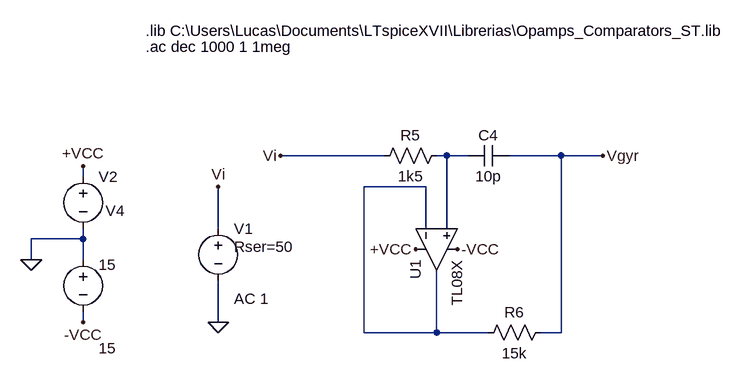
[diagram p0: schematic gyrator.asc]
gyrator.asc, the LTspice schematic file:
Version 4
SHEET 1 932 816
WIRE 192 336 32 336
WIRE 288 336 272 336
WIRE 320 336 288 336
WIRE 464 336 384 336
WIRE 528 336 464 336
WIRE -272 368 -272 352
WIRE 256 384 160 384
WIRE -64 448 -64 384
WIRE 256 448 256 384
WIRE 288 448 288 336
WIRE -272 464 -272 448
WIRE -272 464 -352 464
WIRE -352 496 -352 464
WIRE -272 496 -272 464
WIRE -272 592 -272 576
WIRE -64 592 -64 528
WIRE 160 608 160 384
WIRE 272 608 272 512
WIRE 272 608 160 608
WIRE 352 608 272 608
WIRE 464 608 464 336
WIRE 464 608 432 608
FLAG -64 384 Vi
FLAG -64 592 0
FLAG 32 336 Vi
FLAG -352 496 0
FLAG -272 352 +VCC
FLAG -272 592 -VCC
FLAG 240 480 +VCC
FLAG 304 480 -VCC
FLAG 528 336 Vgyr
SYMBOL voltage -64 432 R0
WINDOW 123 24 124 Left 2
WINDOW 39 24 44 Left 2
SYMATTR Value2 AC 1
SYMATTR SpiceLine Rser=50
SYMATTR InstName V1
SYMATTR Value ""
SYMBOL res 288 320 R90
WINDOW 0 0 56 VBottom 2
WINDOW 3 32 56 VTop 2
SYMATTR InstName R5
SYMATTR Value 1k5
SYMBOL cap 384 320 R90
WINDOW 0 0 32 VBottom 2
WINDOW 3 32 32 VTop 2
SYMATTR InstName C4
SYMATTR Value 10p
SYMBOL Opamps\\opamp2 208 480 M90
SYMATTR InstName U1
SYMATTR Value TL08X
SYMBOL res 448 592 R90
WINDOW 0 0 56 VBottom 2
WINDOW 3 32 56 VTop 2
SYMATTR InstName R6
SYMATTR Value 15k
SYMBOL voltage -272 352 R0
WINDOW 3 24 152 Left 2
WINDOW 123 24 124 Left 2
WINDOW 39 0 0 Left 0
SYMATTR Value 15
SYMATTR InstName V2
SYMBOL voltage -272 480 R0
WINDOW 3 24 152 Left 2
WINDOW 123 24 124 Left 2
WINDOW 39 0 0 Left 0
WINDOW 0 35 -59 Left 2
SYMATTR Value 15
SYMATTR InstName V4
TEXT -176 168 Left 2 !.ac dec 1000 1 1meg
TEXT -176 144 Left 2 !.lib C:\\Users\\Lucas\\Documents\\LTspiceXVII\\Librerias\\Opamps_Comparators_ST.lib

The netlist it stands for:
* gyrator.asc
V1 Vi 0 AC 1 Rser=50
R5 N001 Vi 1k5
C4 Vgyr N001 10p
XU1 N001 N002 +VCC -VCC N002 TL08X  ; pins In+ In- V+ V- OUT
R6 Vgyr N002 15k
V2 +VCC 0 15
V4 0 -VCC 15
.ac dec 1000 1 1meg
.lib C:\Users\Lucas\Documents\LTspiceXVII\Librerias\Opamps_Comparators_ST.lib
.backanno
.end